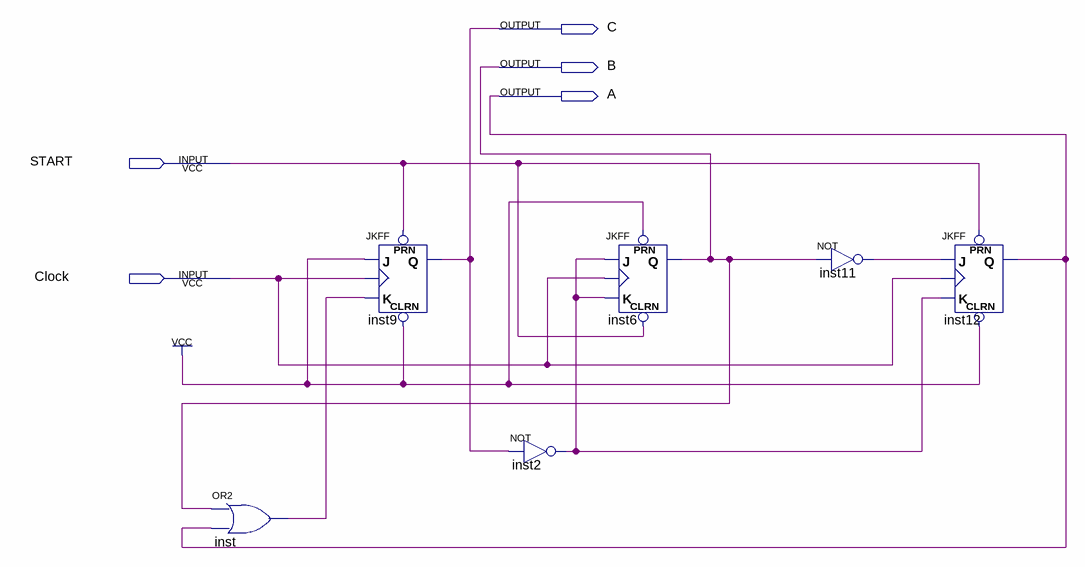
[diagram p0: schematic sheet]
// Quartus schematic Lab12.bdf as structural Verilog: 6 symbols, 5 pins
module Lab12 (
  input  START,
  input  Clock,
  output C,
  output B,
  output A
);

  wire inst2_out, inst11_out, inst_out;

  or inst (inst_out, B, A);
  JKFF inst9 (.PRN(START), .CLRN(1'b1), .K(inst_out), .J(1'b1), .CLK(Clock), .Q(C));
  not inst2 (inst2_out, C);
  JKFF inst6 (.PRN(1'b1), .CLRN(START), .K(inst2_out), .J(inst2_out), .CLK(Clock), .Q(B));
  not inst11 (inst11_out, B);
  JKFF inst12 (.PRN(START), .CLRN(1'b1), .K(inst2_out), .J(inst11_out), .CLK(Clock), .Q(A));
endmodule
